# Altium schematic sheet ESP32 Wroom Design.SchDoc
size A; SheetNumber: 7; SheetTotal: 10
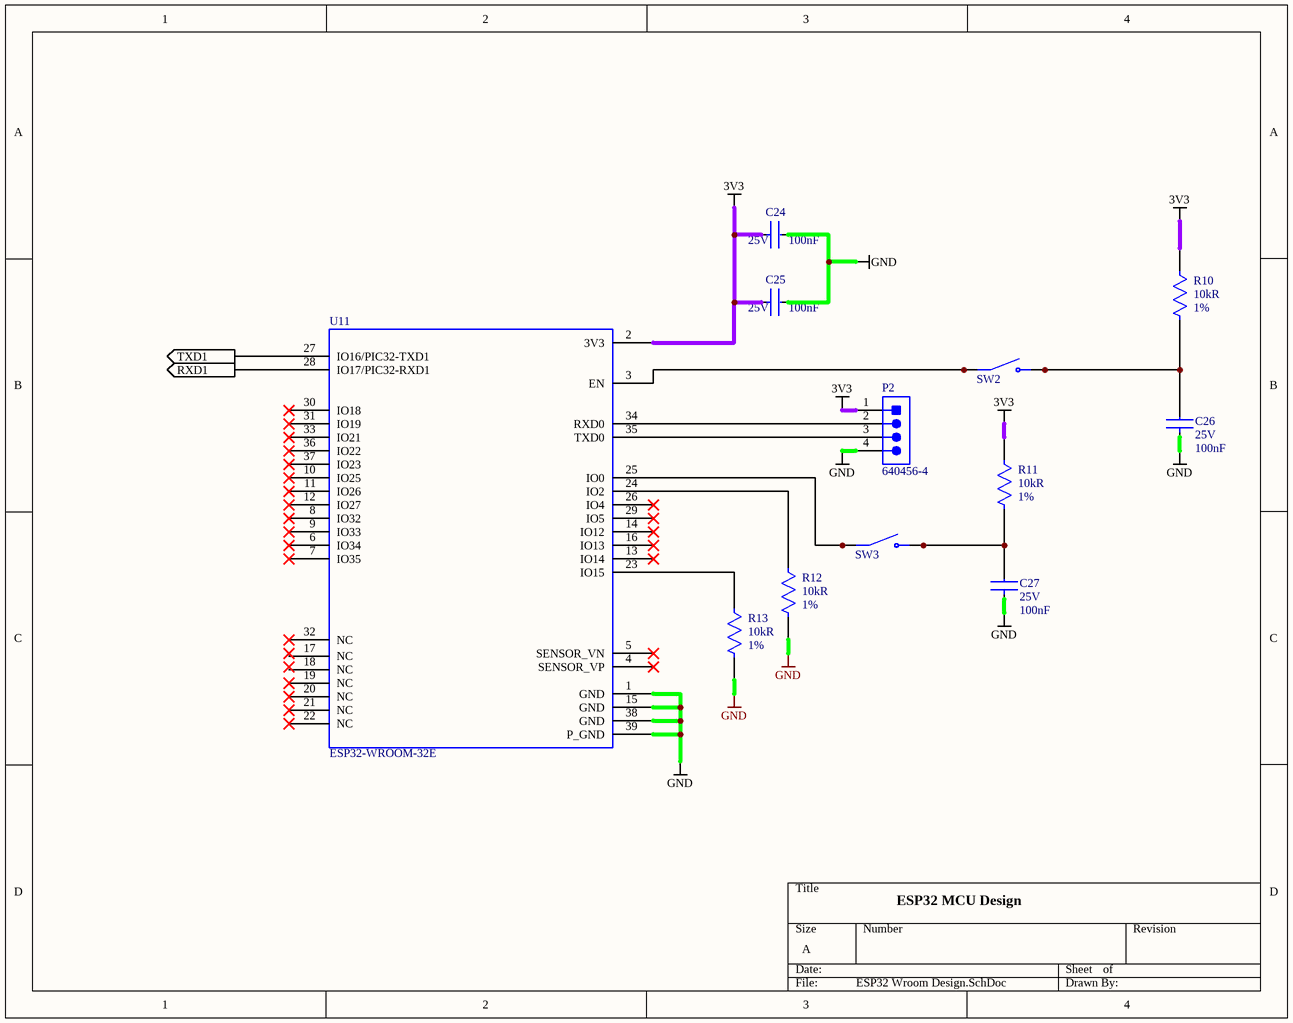
[diagram p0: ESP32 Wroom Design.SchDoc]

## Parts
C24  Voltage: 25V  Capacitance: 100nF  [FP-CL278-IPC_C]
C25  Voltage: 25V  Capacitance: 100nF  [FP-CL278-IPC_C]
C26  Voltage: 25V  Capacitance: 100nF  [FP-CL278-IPC_C]
C27  Voltage: 25V  Capacitance: 100nF  [FP-CL278-IPC_C]
P2  640456-4  [TECO-640456-4]
R10  Resistance: 10kR  Tolerance: 1%  [FP-RMCF0201-IPC_B]  (hidden comment: RMCF0201FT10K0)
R11  Resistance: 10kR  Tolerance: 1%  [FP-RMCF0201-IPC_B]  (hidden comment: RMCF0201FT10K0)
R12  Resistance: 10kR  Tolerance: 1%  [FP-RMCF0201-IPC_B]  (hidden comment: RMCF0201FT10K0)
R13  Resistance: 10kR  Tolerance: 1%  [FP-RMCF0201-IPC_B]  (hidden comment: RMCF0201FT10K0)
SW2  401-1978-ND  [PushButtonSwitch]  (value not drawn)
SW3  401-1978-ND  [PushButtonSwitch]  (value not drawn)
U11  ESP32-WROOM-32E  [ESP32-Wroom-32E]

## Ports
RXD1 (out), TXD1 (out)

## Nets
3V3: C24.1 C25.1 P2.1 R10.1 R11.1 U11.2(3V3)
GND: C24.2 C25.2 C26.1 C27.1 P2.4 R12.2 R13.2 U11.1(GND) U11.15(GND) U11.38(GND) U11.39(P_GND)
RXD1: U11.28(IO17/PIC32-RXD1) ; port RXD1
TXD1: U11.27(IO16/PIC32-TXD1) ; port TXD1
NetC26_2: C26.2 R10.2 SW2.3(NO) SW2.4(NO)
NetC27_2: C27.2 R11.2 SW3.3(NO) SW3.4(NO)
NetP2_2: P2.2 U11.34(RXD0)
NetP2_3: P2.3 U11.35(TXD0)
NetR12_1: R12.1 U11.24(IO2)
NetR13_1: R13.1 U11.23(IO15)
NetSW2_1: SW2.1(COM) SW2.2(COM) U11.3(EN)
NetSW3_1: SW3.1(COM) SW3.2(COM) U11.25(IO0)

Not connected (* = marked no-connect by the designer): U11 4(SENSOR_VP)* 5(SENSOR_VN)* 6(IO34)* 7(IO35)* 8(IO32)* 9(IO33)* 10(IO25)* 11(IO26)* 12(IO27)* 13(IO14)* 14(IO12)* 16(IO13)* 17(NC) 18(NC) 19(NC)* 20(NC)* 21(NC)* 22(NC)* 26(IO4)* 29(IO5)* 30(IO18)* 31(IO19)* 32(NC)* 33(IO21)* 36(IO22)* 37(IO23)*

## Notes on the sheet
- ESP32 MCU Design

## Library data of the parts
C24-C27 = CMP-13271-000728-1: Cap Ceramic 100nF 25V X5R ±10% SMD 0402 +85°C Paper T/R; Package Quantity: 1; Height: 0.5mm; Case Code (Metric): 1005; Thickness: 0.022inch; Mount: Surface Mount; Lead Free: Lead Free; Case Code (Imperial): 0402; Packaging: Tape and Reel; Depth: 0.5mm; Min Operating Temperature: -55°C; Voltage Rating: 25V; Dielectric: X5R; Case/Package: 0402; Tolerance: 10%; Width: 0.02inch; Max Operating Temperature: 85°C; Length: 1mm; Radiation Hardening: No; Voltage Rating (DC): 25V
P2 = CMP-2000-05419-1: Male Header, Pitch 2.54 mm, 1 x 4 Position, Height 10.03 mm, Tail Length 3.56 mm, RoHS, Bulk; Manufacturer: TE Connectivity; Material, Housing: Polyester; Primary Type: InterconnectSystem; Mount Angle: Vertical; Color, Housing: White; Current, Rating: 5 / A; Agency Approvals: CSA,UL; Contact Termination Area Plating: Tin; Temperature, Operating: -55to+105 / degC; Standards: RoHSCompliant,ELVCompliant,UL94V-0; Number of Positions: 4; Brand/Series: MTA-100Series; Angle: Straight; Pin Spacing: 0.1 / "; Material, Contact: CopperAlloy; Connector Type: MTA-100; Special Features: Pinstrip; Mounting Hole Size: 0.04 / "; Contact Centerline Spacing: 0.100 / in.; Voltage, Rating: 250 / V; Manufacturer URL: http://www.te.com/; Length, Pin: 0.14 / "; Length, Overall: 0.4 / "; Color: White; Flammability Rating: UL94V-0; Mounting Type: PCMount; Termination: Solder; Datasheet URL: https://datasheet.ciiva.com/16286/eng-ds-82056-mta-0608-16286228.pdf; Number of Contacts: 4; Contact Shape: Square; Contact Mating Area Plating: Tin; Length, Terminal Post: 0.14 / in.; Size, Post: 0.025 / in.; Contact Plating: Tin; Type: PCBPlug; Datasheet Version: Dec-14; Number of Rows: 1
R10-R13 = CMP-26527-002755-1: RES 10K OHM 1% 1/20W 0201; Max Power Dissipation: 50mW; Temperature Coefficient: 200ppm/°C; Length: 0.024inch; Min Operating Temperature: -55°C; Width: 0.012inch; Contact Plating: Tin; Case/Package: 0201; Power Rating: 50mW; Packaging: Tape and Reel; Resistor Type: Thick Film; Case Code (Metric): 0603; Case Code (Imperial): 0201; Max Operating Temperature: 125°C; Height: 0.009inch; Mount: Surface Mount; Series: RMCF; RoHS Compliant: Yes; Number of Terminations: 2
SW2 SW3 = Push Button Switch
U11 = ESP32-WROOM-32E: Supplier 1: Digi-Key; Supplier Part Number 1: 1965-ESP32-WROOM-32E(4MBHIGHTEMP)DKR-ND